# Altium schematic sheet PeripheralBlockDiagram.SchDoc: Block Diagram
size Letter; Revision: 1.9; SheetNumber: 2; SheetTotal: 2
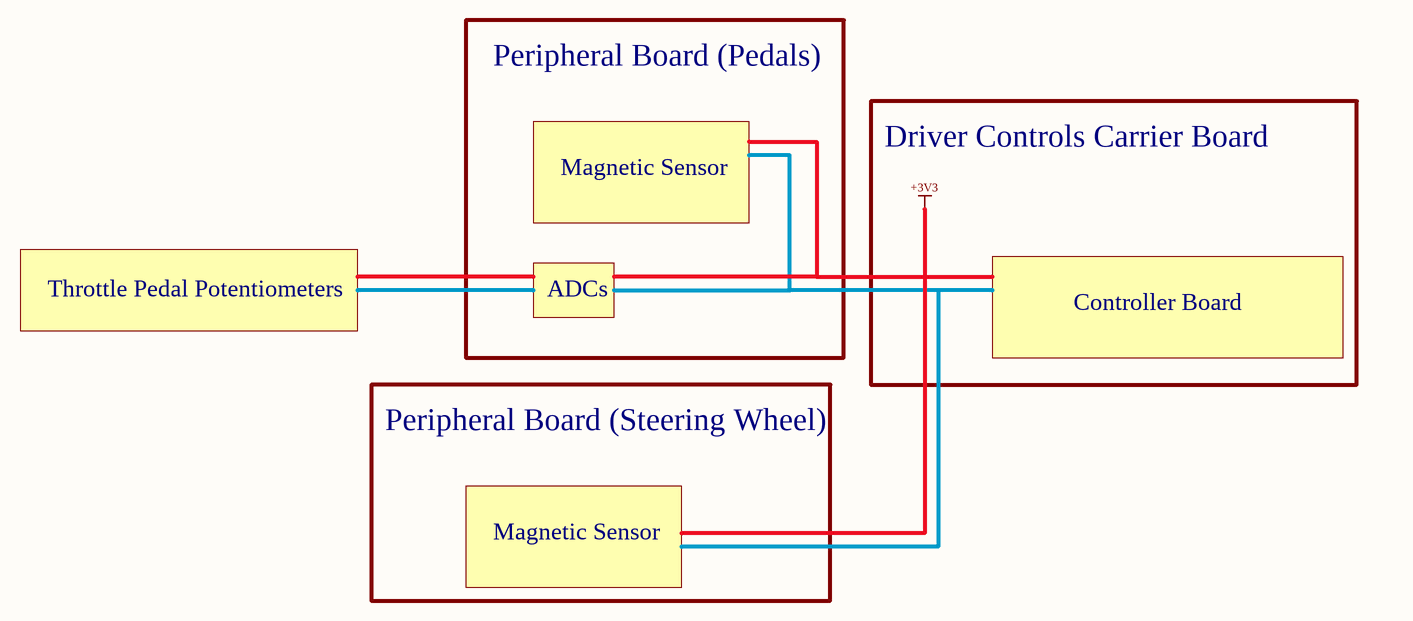
[diagram p0: PeripheralBlockDiagram.SchDoc]

## Notes on the sheet
- Peripheral Board (Pedals)
- Magnetic Sensor
- Driver Controls Carrier Board
- Throttle Pedal Potentiometers
- ADCs
- Controller Board
- Peripheral Board (Steering Wheel)
- Labels drawn without touching a wire or pin: +3V3
- Project:
- Title:
- Size:
- Project Lead:
- Letter
- Revision:
- University of Waterloo
- 200 University Ave W
- Waterloo, ON, Canada
- N2L 3E9
- Date:
- Sheet
- of
- Website: